# EasyEDA Pro project zigbee-plant-sensor-v1.1.epro

# Schematic Schematic1
Board Name: Board1; Create Date: 2025-05-22; Page Name: P1; Project Name: plant-sensor; Schematic Name: Schematic1; Update Date: 2025-06-06; Company: EasyEDA.com; Page Size: A4; Version: V1.0
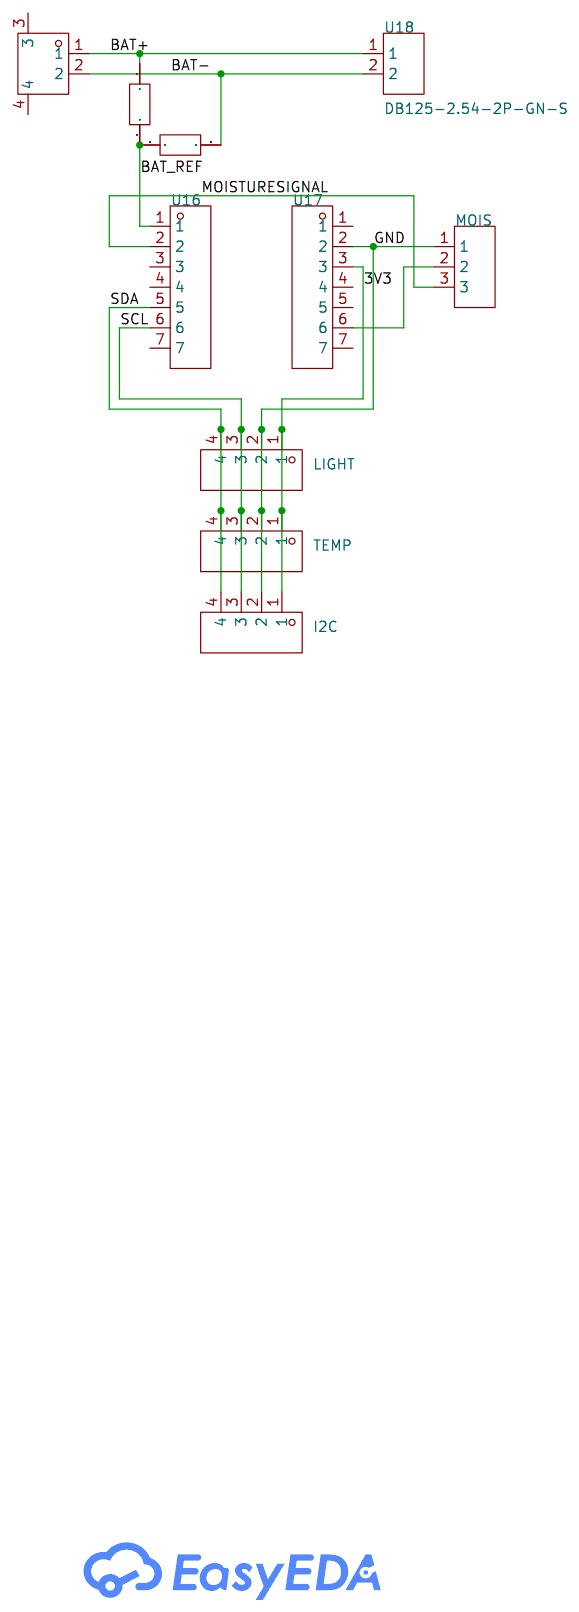
[diagram p0: schematic sheet]

## Parts
CN1  JST-PH-2-SMT-RA  [CONN-SMD_JST-PH-2-SMT-RA]
I2C  5BML8-11732-104-W0  [CONN-TH_5BML8-11732-104-W0]
LIGHT  5BML8-11732-104-W0  [CONN-TH_5BML8-11732-104-W0]
MOIS  HTSW-103-07-S-S  [HDR-TH_3P-P2.54-V-M-1]
R1  200kΩ  [RES-TH_BD2.5-L7.0-P11.00-D0.6]
R2  200kΩ  [RES-TH_BD2.5-L7.0-P11.00-D0.6]
TEMP  5BML8-11732-104-W0  [CONN-TH_5BML8-11732-104-W0]
U16  IPCP254F07PB08V  [HDR-TH_7P-P2.54-V-F]
U17  IPCP254F07PB08V  [HDR-TH_7P-P2.54-V-F]
U18  DB125-2.54-2P-GN-S  [CONN-TH_DB125-2.54-2P-GN]

## Library data of the parts
CN1 = JST-PH-2-SMT-RA: Supplier Part: C9900144926; Supplier Footprint: SMD; Supplier: LCSC
I2C LIGHT TEMP = 5BML8-11732-104-W0: Holes Structure:1x4P Pitch:2.54mm Row Spacing:- Circular Hole / Square Hole:Square Hole Mounting Type:Direct Insert Number of Rows:Single Row Number of Holes:4P Current Rating (Max):3A Voltage Rating (Max):- Holes Direction:Top Insulation Height:8.5mm Con; LCSC Part Name: 1x4P 间距:2.54mm 直插; Supplier Part: C39832998; Manufacturer: SAMZO(三佐); Supplier Footprint: 插件,P=2.54mm; JLCPCB Part Class: Extended Part; Datasheet: https://atta.szlcsc.com/upload/public/pdf/source/20240809/ACE57C45F93890FAF99D084A12755BA9.pdf; Supplier: LCSC; Holes Structure: 1x4P; Pitch: 2.54mm; Circular Hole / Square Hole: Square Hole; Mounting Type: Direct Insert; Number of Rows: Single Row; Number of Holes: 4P; Current Rating (Max): 3A; Holes Direction: Top; Insulation Height: 8.5mm; Contact Material: Brass; Contact Plating: Gold; Operating Temperature Range: -40℃~+105℃
MOIS = HTSW-103-07-S-S: Pitch:2.54mm Mounting Type:Straight Number of Rows:Single Row Number of Pins:3P Contact Material:Phosphor Bronze Contact Plating:Tin Operating Temperature:-55℃~+125℃ Operating Temperature:-55℃~+125℃; LCSC Part Name: 间距:2.54mm 直插; Supplier Part: C5654765; Manufacturer: SAMTEC; Supplier Footprint: 插件,P=2.54mm; JLCPCB Part Class: Extended Part; Datasheet: https://atta.szlcsc.com/upload/public/pdf/source/20230428/741833D6B396B73F25D457C752682A0D.pdf; Supplier: LCSC; Pitch: 2.54mm; Mounting Type: Straight; Number of Rows: Single Row; Number of Pins: 3P; Contact Material: Phosphor Bronze; Contact Plating: Tin; Operating Temperature: -55℃~+125℃
R1 R2 = OD204J: Type:Carbon Composite Resistor Resistance:200kΩ Tolerance:±5% Tolerance:±5% Power(Watts):250mW; LCSC Part Name: 碳成分电阻 200kΩ ±5% 250mW; Supplier Part: C19469364; Manufacturer: Ohmite; Supplier Footprint: 插件; JLCPCB Part Class: Extended Part; Datasheet: https://atta.szlcsc.com/upload/public/pdf/source/231023/res_od_of_oa.pdf-c7c6e6c01a2cbdf8a395c2125b0650e8.pdf; Supplier: LCSC; Type: Carbon Composite Resistor; Tolerance: ±5%; Power(Watts): 250mW
U16 U17 = IPCP254F07PB08V: Holes Structure:1x7P Pitch:2.54mm Circular Hole / Square Hole:Square Hole Mounting Type:Direct Insert Number of Rows:Single Row Number of Holes:7P Current Rating (Max):3A Voltage Rating (Max):- Insulation Height:8.5mm Contact Material:Brass Contact Platin; LCSC Part Name: 1x7P 间距:2.54mm 直插; Supplier Part: C22438465; Manufacturer: INCP; Supplier Footprint: 插件,P=2.54mm; JLCPCB Part Class: Extended Part; Datasheet: https://atta.szlcsc.com/upload/public/pdf/source/20240523/6A36805F5B2B6DF79759E177043CFD1C.pdf; Supplier: LCSC; Holes Structure: 1x7P; Pitch: 2.54mm; Circular Hole / Square Hole: Square Hole; Mounting Type: Direct Insert; Number of Rows: Single Row; Number of Holes: 7P; Current Rating (Max): 3A; Insulation Height: 8.5mm; Contact Material: Brass; Contact Plating: Gold; Operating Temperature Range: -40℃~+105℃
U18 = DB125-2.54-2P-GN-S: Number of Positions or Pins:1x2P Pitch:2.54mm Color:Green Mounting Type:Direct Insert Number of Pins:2P Number of Rows:1 Number of PINs Per Row:2 Current Rating:7A Voltage Rating (Max):150V Wire Gauge - AWG:18~26 Wire Gauge - AWG:18~26 Wire Gauge - mm2:1; LCSC Part Name: 1x2P 2.54mm 直插 排数:1 每排P数:2; Supplier Part: C918120; Manufacturer: DORABO(地博电气); Supplier Footprint: 插件,P=2.54mm; JLCPCB Part Class: Extended Part; Datasheet: https://atta.szlcsc.com/upload/public/pdf/source/20230106/BCD3A0BE1EB95DC3E813F1745F022035.pdf; Supplier: LCSC; Number of Positions or Pins: 1x2P; Pitch: 2.54mm; Color: Green; Mounting Type: Direct Insert; Number of Pins: 2P; Number of Rows: 1; Number of PINs Per Row: 2; Current Rating: 7A; Voltage Rating (Max): 150V; Wire Gauge - AWG: 18~26; Wire Gauge - mm2: 1; Operating Temperature: -40℃~+105℃

## Nets
3V3: I2C.1 LIGHT.1 TEMP.1 U17.3
GND: I2C.2 LIGHT.2 MOIS.1 TEMP.2 U17.2
BAT+: CN1.1 R1.1 U18.1
BAT-: CN1.2 R2.2 U18.2
BAT_REF: R1.2 R2.1 U16.1
MOISTURESIGNAL: MOIS.3 U16.2
SCL: I2C.3 LIGHT.3 TEMP.3 U16.6
SDA: I2C.4 LIGHT.4 TEMP.4 U16.5
Net-(MOIS-2): MOIS.2 U17.6

Not connected (* = marked no-connect by the designer): CN1 3 4; U16 3 4 7; U17 1 4 5 7

# Board PCB1_1
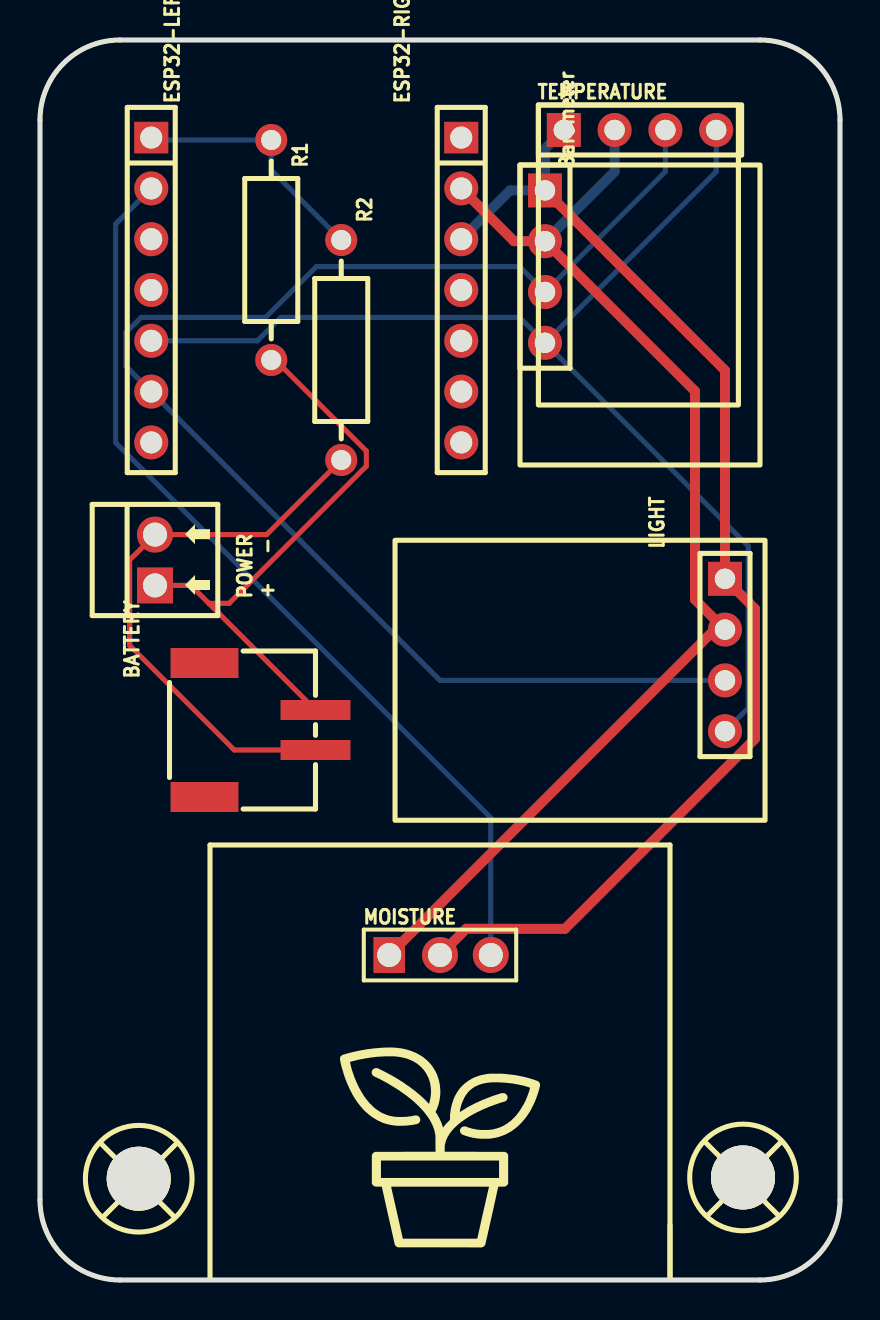
[diagram p1: board, top side]
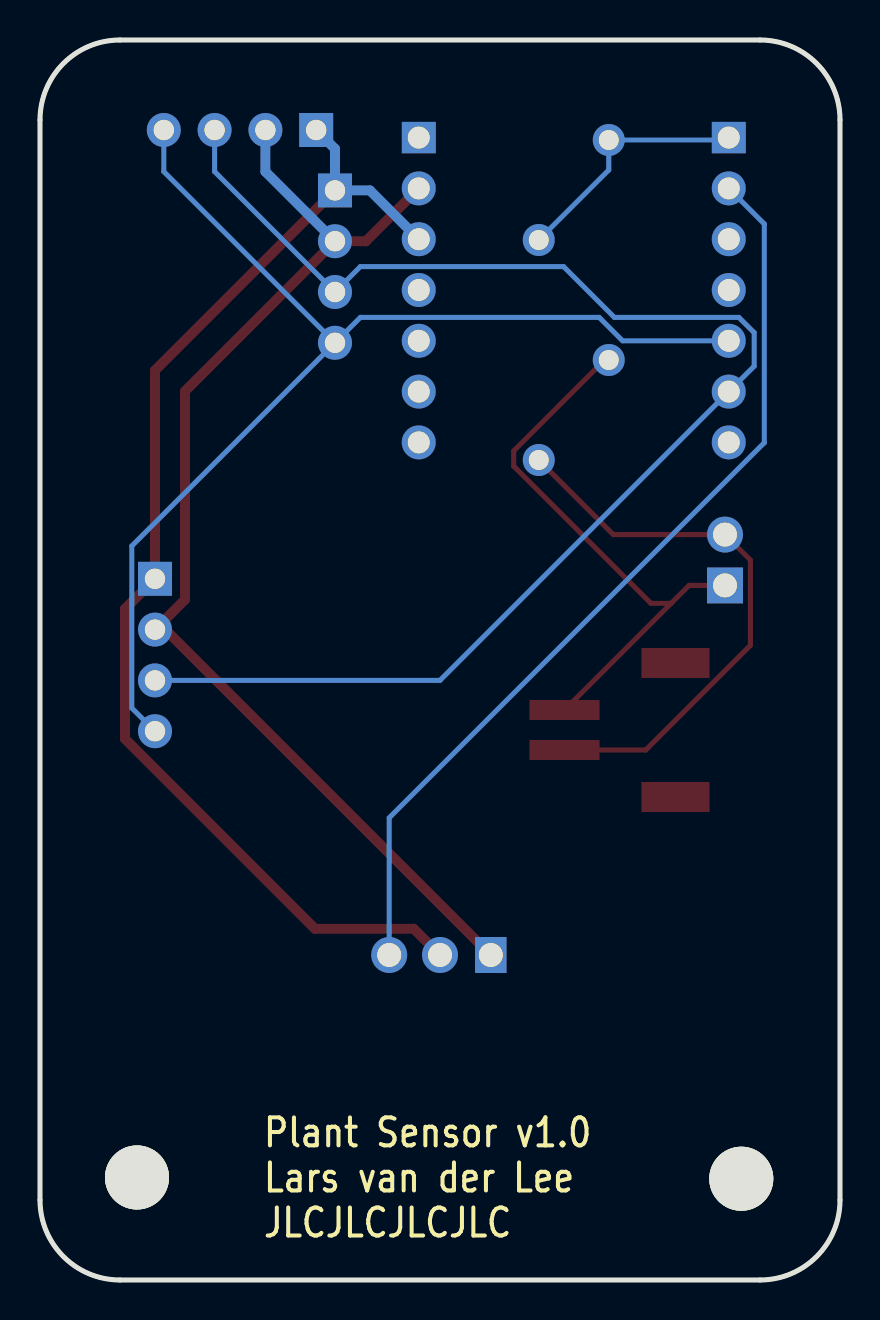
[diagram p2: board, bottom side, seen from below]

Outline 40 x 62 mm; copper layers: Top Layer, Inner1, Inner2, Inner3, Inner4, Inner5, Inner6, Inner7, Inner8, Inner9, Inner10, Inner11, Inner12, Inner13, Inner14, Inner15, Inner16, Inner17, Inner18, Inner19, Inner20, Inner21, Inner22, Inner23, Inner24, Inner25, Inner26, Inner27, Inner28, Inner29, Inner30, Bottom Layer. Coordinates in mm from the lower left corner of the outline.
Outline path: 0,58 0,4 arc(1.17,1.17) 4,0 36,0 arc(38.83,1.17) 40,4 40,58 arc(38.83,60.83) 36,62 4,62 arc(1.17,60.83) 0,58
Stack: Top Layer 0.035mm / Dielectric1 1.51mm FR4 er 4.5 / Bottom Layer 0.035mm

## Design rules (mm)
template: Custom Config
spacing copperThickness1oz (default): track to track 0.102, other pairs 0.152 to 0.3
spacing copperThickness2oz: track to track 0.203, other pairs 0.152 to 0.3
track width copperThickness1oz (default): min 0.127, default 0.254, max 2.54
track width copperThickness2oz: min 0.203, default 0.254, max 2.54
track width wide: min 0.5, default 0.5, max 0.5
differential pair differentialPair (default): width min 0.127, default 0.254, max 2.54; gap min 0.152, default 0.152
via viaSize (default): diameter min 0.5, default 0.61, max 10; hole min 0.3, default 0.305, max 6.3
net 3V3 uses wide
net GND uses wide

## Placement (name value [footprint] x y rotation side)
Barometer  -  [CONN-TH_5BML8-11732-104-W0]  25.25 50.67 270 top
BATTERY  -  [CONN-SMD_JST-PH-2-SMT-RA]  11 27.5 270 top
ESP32-LEFT  -  [HDR-TH_7P-P2.54-V-F]  5.56 49.5 270 top
ESP32-RIGHT  -  [HDR-TH_7P-P2.54-V-F]  21.06 49.5 270 top
LIGHT  -  [CONN-TH_5BML8-11732-104-W0]  34.25 31.25 270 top
MOISTURE  -  [HDR-TH_3P-P2.54-V-M-1]  20 16.25 0 top
POWER
+   -  -  [CONN-TH_DB125-2.54-2P-GN]  5.75 36 90 top
R1  -  [RES-TH_BD2.5-L7.0-P11.00-D0.6]  11.56 51.5 90 top
R2  -  [RES-TH_BD2.5-L7.0-P11.00-D0.6]  15.06 46.5 270 top
TEMPERATURE  -  [CONN-TH_5BML8-11732-104-W0]  30 57.5 0 top
U19  -  [Screw-Hole-M3]  5 5 0 top
U20  -  [Screw-Hole-M3]  35.21 5.06 0 top

## Footprints (pads in the part's own frame, mm; a bottom-side part is the same pattern mirrored in y, then rotated)
CONN-SMD_JST-PH-2-SMT-RA
  rect 1x3.5 smd: 1(-1,2.775) 2(1,2.775)
  rect 1.5x3.4 smd: 3(-3.35,-2.775) 4(3.35,-2.775)
CONN-TH_5BML8-11732-104-W0
  rect 1.7x1.7 hole 1.02: 1(-3.81,0)
  round 1.7 hole 1.02: 2(-1.27,0) 3(1.27,0) 4(3.81,0)
CONN-TH_DB125-2.54-2P-GN
  rect 1.8x1.8 hole 1.2: 1(-1.27,0)
  round 1.8 hole 1.2: 2(1.27,0)
HDR-TH_3P-P2.54-V-M-1
  rect 1.575x1.8 hole 1.2: 1(-2.54,0)
  round 1.8 hole 1.2: 2(0,0) 3(2.54,0)
HDR-TH_7P-P2.54-V-F
  rect 1.575x1.7 hole 1.1: 1(-7.62,0)
  round 1.7 hole 1.1: 2(-5.08,0) 3(-2.54,0) 4(0,0) 5(2.54,0) 6(5.08,0) 7(7.62,0)
RES-TH_BD2.5-L7.0-P11.00-D0.6
  round 1.6 hole 1: 1(-5.5,0) 2(5.5,0)
Screw-Hole-M3
  round 3.2 hole 3.2: 1(-0.064,0.064)

## Nets
3V3: Barometer.1 ESP32-RIGHT.3 LIGHT.1 MOISTURE.2 TEMPERATURE.1
GND: Barometer.2 ESP32-RIGHT.2 LIGHT.2 MOISTURE.1 TEMPERATURE.2
BAT+: BATTERY.1 POWER
+   -.1 R1.1
BAT-: BATTERY.2 POWER
+   -.2 R2.2
BAT_REF: ESP32-LEFT.1 R1.2 R2.1
MOISTURESIGNAL: ESP32-LEFT.2 MOISTURE.3
SCL: Barometer.3 ESP32-LEFT.6 LIGHT.3 TEMPERATURE.3
SDA: Barometer.4 ESP32-LEFT.5 LIGHT.4 TEMPERATURE.4

Pads without a net: BATTERY 3 4; ESP32-LEFT 3 4 7; ESP32-RIGHT 1 4 5 6 7; U19 1; U20 1

## Routing (per net, layer and track width the routed paths; a pad name or vN(x,y) marks a point on that pad's centre or on a via; arc(x,y) is an arc through that point)
3V3: length 60.6
  Top Layer w0.5: MOISTURE.2 21.31,17.56 26.25,17.56 35.75,27.06 35.75,33.56 LIGHT.1 34.25,45.48 Barometer.1
  Bottom Layer w0.5: TEMPERATURE.1 25.25,56.56 Barometer.1 23.5,54.48 ESP32-RIGHT.3
GND: length 58.9
  Top Layer w0.5: 33.75,33.02 33.75,32.54 MOISTURE.1 ; 33.75,33.02 LIGHT.2 ; 33.75,33.02 32.75,34.02 32.75,44.44 Barometer.2 23.7,51.94 ESP32-RIGHT.2
  Bottom Layer w0.5: TEMPERATURE.2 28.73,55.42 Barometer.2
BAT+: length 28.7
  Top Layer w0.254: BATTERY.1 8.44,33.83 ; 8.44,33.83 9.46,33.83 16.31,40.69 16.31,41.45 12,45.77 11.79,45.77 R1.1 ; 8.44,33.83 7.54,34.73 POWER
+   -.1
BAT-: length 28.4
  Top Layer w0.254: R2.2 11.33,37.27 POWER
+   -.2 4.48,36 4.48,31.73 9.71,26.5 BATTERY.2
BAT_REF: length 12.5
  Bottom Layer w0.254: R2.1 11.56,55.5 R1.2 5.68,57 ESP32-LEFT.1
MOISTURESIGNAL: length 46.8
  Bottom Layer w0.254: ESP32-LEFT.2 3.78,52.8 3.78,41.86 22.54,23.11 MOISTURE.3
SCL: length 71.6
  Bottom Layer w0.254: TEMPERATURE.3 31.27,55.42 Barometer.3 23.98,50.67 13.82,50.67 11.28,48.13 5.05,48.13 4.29,47.37 4.29,45.69 ESP32-LEFT.6 20,29.98 LIGHT.3
SDA: length 59
  Bottom Layer w0.254: LIGHT.4 35.41,28.6 35.41,36.7 Barometer.4 ; Barometer.4 33.81,55.42 TEMPERATURE.4 ; Barometer.4 23.98,48.13 12.04,48.13 10.87,46.96 ESP32-LEFT.5

## Text on the board
Bottom Silkscreen Layer: Plant Sensor v1.0 / Lars van der Lee / JLCJLCJLCJLC

# Board PCB1
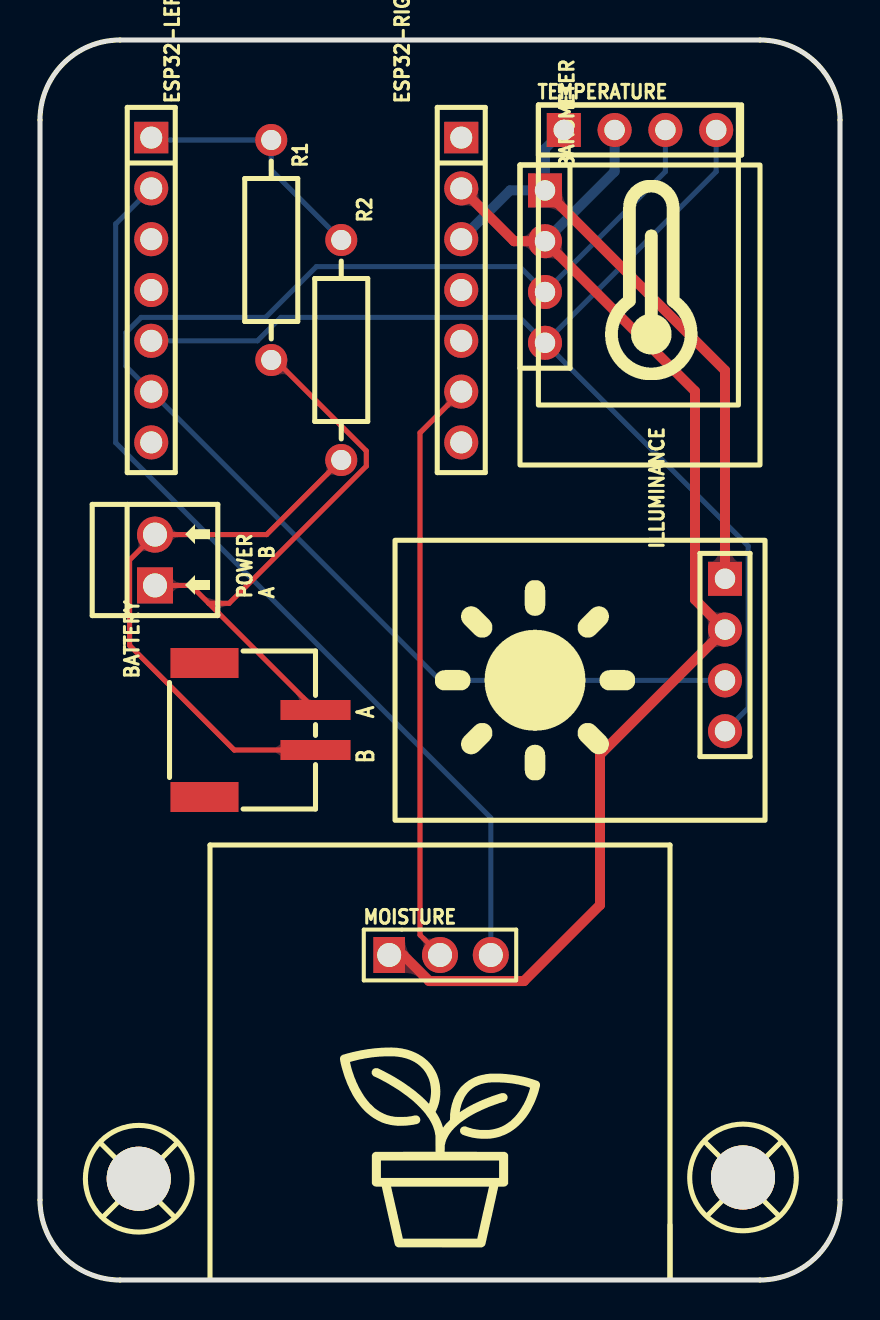
[diagram p3: board, top side]
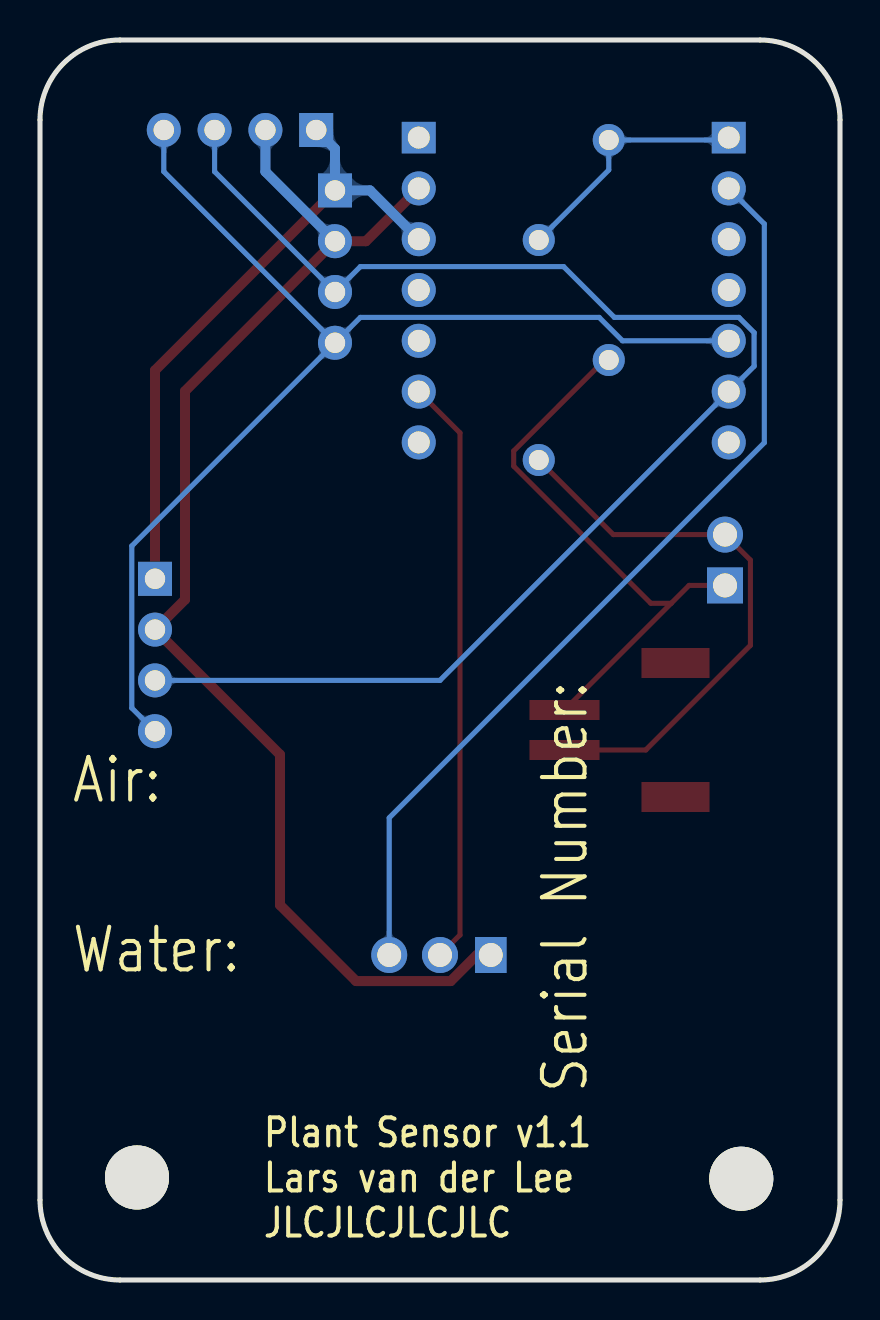
[diagram p4: board, bottom side, seen from below]

Outline 40 x 62 mm; copper layers: Top Layer, Bottom Layer. Coordinates in mm from the lower left corner of the outline.
Outline path: 0,58 0,4 arc(1.17,1.17) 4,0 36,0 arc(38.83,1.17) 40,4 40,58 arc(38.83,60.83) 36,62 4,62 arc(1.17,60.83) 0,58
Stack: Top Layer 0.035mm / Dielectric1 1.51mm FR4 er 4.5 / Bottom Layer 0.035mm

## Design rules (mm)
template: Custom Config
spacing copperThickness1oz (default): track to track 0.102, other pairs 0.152 to 0.3
spacing copperThickness2oz: track to track 0.203, other pairs 0.152 to 0.3
track width copperThickness1oz (default): min 0.127, default 0.254, max 2.54
track width copperThickness2oz: min 0.203, default 0.254, max 2.54
track width wide: min 0.5, default 0.5, max 0.5
differential pair differentialPair (default): width min 0.127, default 0.254, max 2.54; gap min 0.152, default 0.152
via viaSize (default): diameter min 0.5, default 0.61, max 10; hole min 0.3, default 0.305, max 6.3
net 3V3 uses wide
net GND uses wide

## Placement (name value [footprint] x y rotation side)
BAROMETER  -  [CONN-TH_5BML8-11732-104-W0]  25.25 50.67 270 top
BATTERY  -  [CONN-SMD_JST-PH-2-SMT-RA]  11 27.5 270 top
ESP32-LEFT  -  [HDR-TH_7P-P2.54-V-F]  5.56 49.5 270 top
ESP32-RIGHT  -  [HDR-TH_7P-P2.54-V-F]  21.06 49.5 270 top
ILLUMINANCE  -  [CONN-TH_5BML8-11732-104-W0]  34.25 31.25 270 top
MOISTURE  -  [HDR-TH_3P-P2.54-V-M-1]  20 16.25 0 top
POWER
A   B  -  [CONN-TH_DB125-2.54-2P-GN]  5.75 36 90 top
R1  200kΩ  [RES-TH_BD2.5-L7.0-P11.00-D0.6]  11.56 51.5 90 top
R2  200kΩ  [RES-TH_BD2.5-L7.0-P11.00-D0.6]  15.06 46.5 270 top
TEMPERATURE  -  [CONN-TH_5BML8-11732-104-W0]  30 57.5 0 top
U19  -  [Screw-Hole-M3]  5 5 0 top
U20  -  [Screw-Hole-M3]  35.21 5.06 0 top

## Footprints (pads in the part's own frame, mm; a bottom-side part is the same pattern mirrored in y, then rotated)
CONN-SMD_JST-PH-2-SMT-RA
  rect 1x3.5 smd: 1(-1,2.775) 2(1,2.775)
  rect 1.5x3.4 smd: 3(-3.35,-2.775) 4(3.35,-2.775)
CONN-TH_5BML8-11732-104-W0
  rect 1.7x1.7 hole 1.02: 1(-3.81,0)
  round 1.7 hole 1.02: 2(-1.27,0) 3(1.27,0) 4(3.81,0)
CONN-TH_DB125-2.54-2P-GN
  rect 1.8x1.8 hole 1.2: 1(-1.27,0)
  round 1.8 hole 1.2: 2(1.27,0)
HDR-TH_3P-P2.54-V-M-1
  rect 1.575x1.8 hole 1.2: 1(-2.54,0)
  round 1.8 hole 1.2: 2(0,0) 3(2.54,0)
HDR-TH_7P-P2.54-V-F
  rect 1.575x1.7 hole 1.1: 1(-7.62,0)
  round 1.7 hole 1.1: 2(-5.08,0) 3(-2.54,0) 4(0,0) 5(2.54,0) 6(5.08,0) 7(7.62,0)
RES-TH_BD2.5-L7.0-P11.00-D0.6
  round 1.6 hole 1: 1(-5.5,0) 2(5.5,0)
Screw-Hole-M3
  round 3.2 hole 3.2: 1(-0.064,0.064)

## Nets
3V3: BAROMETER.1 ESP32-RIGHT.3 ILLUMINANCE.1 TEMPERATURE.1
GND: BAROMETER.2 ESP32-RIGHT.2 ILLUMINANCE.2 MOISTURE.1 TEMPERATURE.2
BAT+: BATTERY.1 POWER
A   B.1 R1.1
BAT-: BATTERY.2 POWER
A   B.2 R2.2
BAT_REF: ESP32-LEFT.1 R1.2 R2.1
MOISTURESIGNAL: ESP32-LEFT.2 MOISTURE.3
SCL: BAROMETER.3 ESP32-LEFT.6 ILLUMINANCE.3 TEMPERATURE.3
SDA: BAROMETER.4 ESP32-LEFT.5 ILLUMINANCE.4 TEMPERATURE.4
$1N2936: ESP32-RIGHT.6 MOISTURE.2

Pads without a net: BATTERY 3 4; ESP32-LEFT 3 4 7; ESP32-RIGHT 1 4 5 7; U19 1; U20 1

## Routing (per net, layer and track width the routed paths; a pad name or vN(x,y) marks a point on that pad's centre or on a via; arc(x,y) is an arc through that point)
3V3: length 31.8
  Top Layer w0.5: BAROMETER.1 34.25,45.48 ILLUMINANCE.1
  Bottom Layer w0.5: TEMPERATURE.1 25.25,56.56 BAROMETER.1 23.5,54.48 ESP32-RIGHT.3
GND: length 64.4
  Top Layer w0.5: MOISTURE.1 18.16,16.25 19.46,14.95 24.2,14.95 28,18.75 28,26.27 ILLUMINANCE.2 32.75,34.02 32.75,44.44 BAROMETER.2 23.7,51.94 ESP32-RIGHT.2
  Bottom Layer w0.5: BAROMETER.2 28.73,55.42 TEMPERATURE.2
BAT+: length 28.7
  Top Layer w0.254: R1.1 11.79,45.77 12,45.77 16.31,41.45 16.31,40.69 9.46,33.83 8.44,33.83 ; BATTERY.1 8.44,33.83 ; 8.44,33.83 7.54,34.73 POWER
A   B.1
BAT-: length 28.4
  Top Layer w0.254: BATTERY.2 9.71,26.5 4.48,31.73 4.48,36 POWER
A   B.2 11.33,37.27 R2.2
BAT_REF: length 12.5
  Bottom Layer w0.254: R2.1 11.56,55.5 R1.2 5.68,57 ESP32-LEFT.1
MOISTURESIGNAL: length 46.8
  Bottom Layer w0.254: MOISTURE.3 22.54,23.11 3.78,41.86 3.78,52.8 ESP32-LEFT.2
SCL: length 71.6
  Bottom Layer w0.254: ILLUMINANCE.3 20,29.98 ESP32-LEFT.6 4.29,45.69 4.29,47.37 5.05,48.13 11.28,48.13 13.82,50.67 23.98,50.67 BAROMETER.3 31.27,55.42 TEMPERATURE.3
SDA: length 59
  Bottom Layer w0.254: BAROMETER.4 23.98,48.13 12.04,48.13 10.87,46.96 ESP32-LEFT.5 ; BAROMETER.4 35.41,36.7 35.41,28.6 ILLUMINANCE.4 ; BAROMETER.4 33.81,55.42 TEMPERATURE.4
$1N2936: length 29.4
  Top Layer w0.254: ESP32-RIGHT.6 19,42.36 19,17.25 MOISTURE.2

Small or netless copper shapes (teardrops, artwork), in the pictures only: 18 on Top Layer, 24 on Bottom Layer

## Text on the board
Bottom Silkscreen Layer: Plant Sensor v1.1 / Lars van der Lee / JLCJLCJLCJLC | Air: | Water: | Serial Number:
Top Silkscreen Layer: B   A
